# EAGLE schematic Base_Unit schematic (EAGLE 7.6.0)
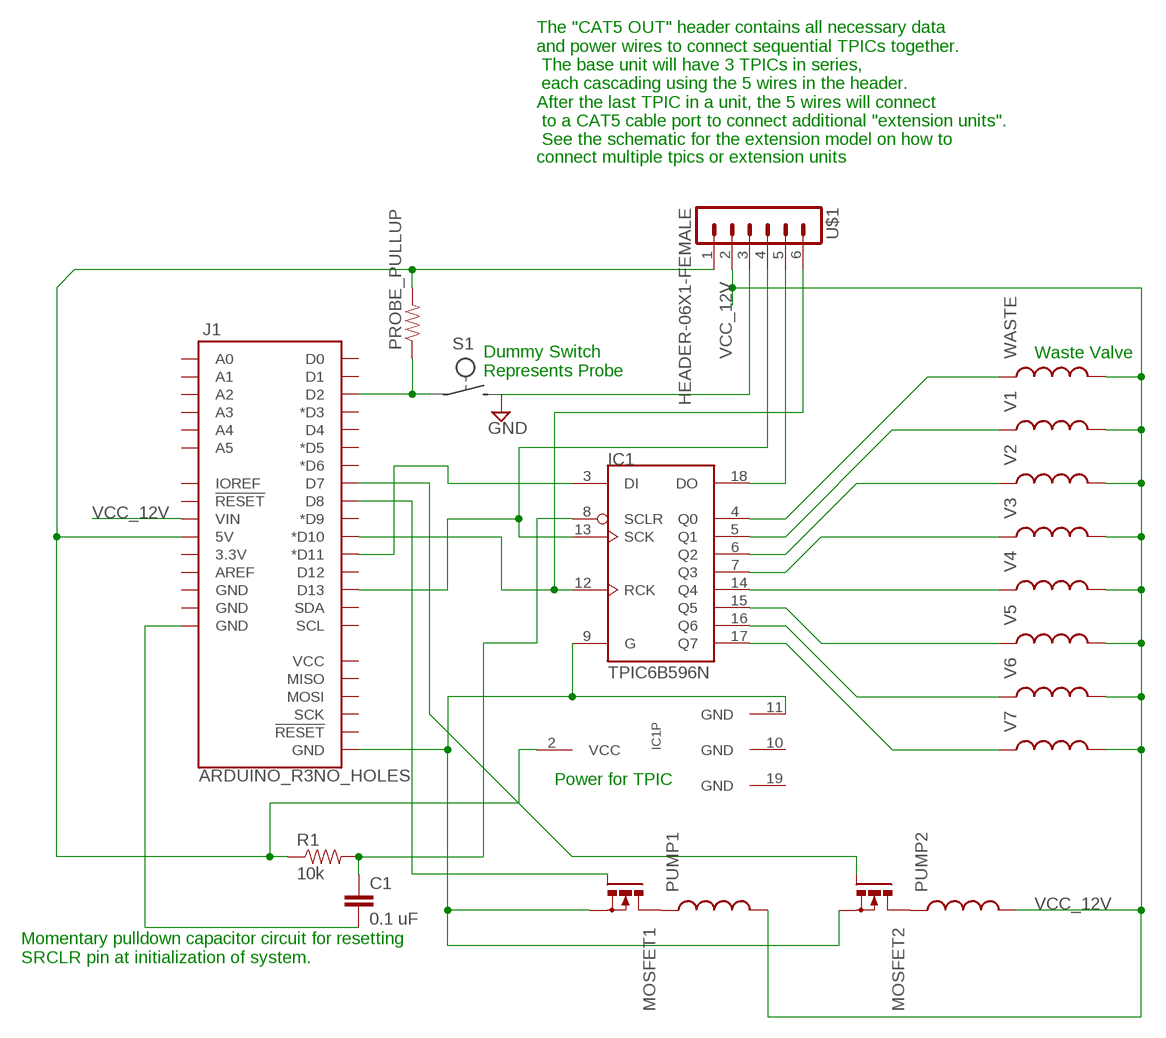
[diagram p0: schematic, sheet 1]

## Parts
C1  0.1 uF  CAP_  [AXIAL-5MM]
IC1  TPIC6B596N  [DIL20]
J1  ARDUINO_R3NO_HOLES  [ARDUINO_R3_NO_HOLES]
MOSFET1  PMOSFET_NTO220BV  [TO220BV]
MOSFET2  PMOSFET_NTO220BV  [TO220BV]
PROBE_PULLUP  RESISTORAXIAL-0.3  [AXIAL-0.3]
PUMP1  INDUCTOR  [INDUCTOR-SRP4020]
PUMP2  INDUCTOR  [INDUCTOR-SRP4020]
R1  10k  RESISTORAXIAL-0.3  [AXIAL-0.3]
U$1  HEADER-06X1-FEMALE  [06X1-PTH]
V1  INDUCTOR  [INDUCTOR-SRP4020]
V2  INDUCTOR  [INDUCTOR-SRP4020]
V3  INDUCTOR  [INDUCTOR-SRP4020]
V4  INDUCTOR  [INDUCTOR-SRP4020]
V5  INDUCTOR  [INDUCTOR-SRP4020]
V6  INDUCTOR  [INDUCTOR-SRP4020]
V7  INDUCTOR  [INDUCTOR-SRP4020]
WASTE  INDUCTOR  [INDUCTOR-SRP4020]

## Nets
GND: U$1.3
N$3: J1.D7 MOSFET2.G
N$4: IC1.12(RCK) J1.D10(*D10) U$1.6
N$5: MOSFET1.D PUMP1.P$1
N$6: IC1.4(Q0) WASTE.P$1
N$7: IC1.5(Q1) V1.P$1
N$8: IC1.6(Q2) V2.P$1
N$9: IC1.7(Q3) V3.P$1
N$10: IC1.14(Q4) V4.P$1
N$11: IC1.15(Q5) V5.P$1
N$12: IC1.16(Q6) V6.P$1
N$13: IC1.17(Q7) V7.P$1
N$14: J1.D2 PROBE_PULLUP.P$1
N$15: MOSFET2.D PUMP2.P$1
N$16: IC1.9(G) IC1.11(GND) J1.GND@1(GND) MOSFET1.S MOSFET2.S
N$17: J1.D8 MOSFET1.G
N$18: IC1.2(VCC) J1.5V PROBE_PULLUP.P$2 R1.P$1 U$1.1
N$19: IC1.3(DI) J1.D11(*D11)
N$20: IC1.13(SCK) J1.D13 U$1.4
N$21: IC1.18(DO) U$1.5
N$22: C1.P$1 IC1.8(SCLR) R1.P$2
N$23: C1.P$2 J1.GND@2(GND)
VCC_12V: J1.VIN PUMP1.P$2 PUMP2.P$2 U$1.2 V1.P$2 V2.P$2 V3.P$2 V4.P$2 V5.P$2 V6.P$2 V7.P$2 WASTE.P$2
Unconnected: J1.3.3V J1.A0 J1.A1 J1.A2 J1.A3 J1.A4 J1.A5 J1.AREF J1.D0 J1.D1 J1.D3(*D3) J1.D4 J1.D5(*D5) J1.D6(*D6) J1.D9(*D9) J1.D12 J1.GND@3(GND) J1.GND@4(GND) J1.IOREF J1.MISO J1.MOSI J1.RESET@1(!RESET!) J1.RESET@2(!RESET!) J1.SCK J1.SCL J1.SDA J1.VCC

## Notes on the sheet
- The "CAT5 OUT" header contains all necessary data
  and power wires to connect sequential TPICs together.
   The base unit will have 3 TPICs in series,
   each cascading using the 5 wires in the header. 
  After the last TPIC in a unit, the 5 wires will connect
   to a CAT5 cable port to connect additional "extension units".
   See the schematic for the extension model on how to
- connect multiple tpics or extension units
- Waste Valve
- Dummy Switch
  Represents Probe
- Power for TPIC
- Momentary pulldown capacitor circuit for resetting
  SRCLR pin at initialization of system.

## Power pins joined to a net without a drawn wire
GND: IC1.10(GND) IC1.19(GND)

## Library data of the parts
C1 = SparkFun-Capacitors:CAP: Capacitor Standard 0603 ceramic capacitor, and 0.1" leaded capacitor.
IC1 = tpic:TPIC6B596
J1 = SparkFun-Boards:ARDUINO_R3: Arduino R3 Footprint (w/ SPI header)
MOSFET1 MOSFET2 = transistor-power:PMOSFET_N: Power MOSFET N-Channel
PROBE_PULLUP = SparkFun-Resistors:RESISTOR: Resistor Basic schematic elements and footprints for 0603, 1206, and PTH resistors.
PUMP1 PUMP2 V1-V7 WASTE = SparkFun-Passives:INDUCTOR: Inductors Basic Inductor/Choke - 0603 and 1206. Footprints are not proven and vary greatly between part numbers. INDUCTOR POWER 3.3UH 4.0A SMD 0.197" L x 0.197" W x 0.177" H (5.00mm x 5.00mm x 4.50mm)
R1 = SparkFun-Passives:RESISTOR: Resistor Basic schematic elements and footprints for 0603, 1206, and PTH resistors.
U$1 = GeekAmmo:HEADER-06X1?: 6 x 0.1 inch Header 40x1 0.1inch Male Breakaway header can be used. - 4UCON 00834 <http://www.4uconnector.com/online/SearchPro.asp?FormName=ProSearch&FormAction=search&s_GroupNo=&s_keyword=00834> For female part, if possible use 6 x 1 without breaking.